# EAGLE schematic morse (EAGLE 7.0.0)
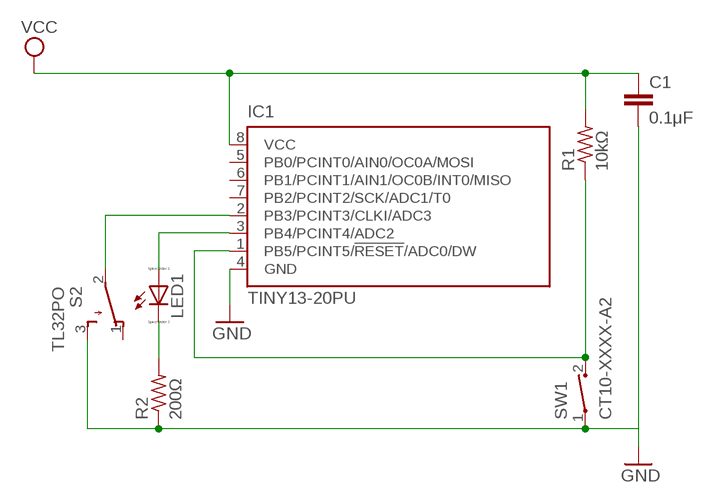
[diagram p0: schematic, sheet 1]

## Parts
C1  0.1μF  C2,5-3  [C2.5-3]
IC1  TINY13-20PU  [DIL08]
LED1  LED_ELD260  [LED_LD260]
R1  10kΩ  R-US_0204/7  [0204/7]
R2  200Ω  R-US_0204/7  [0204/7]
S2  TL32PO  [TL3XPO]
SW1  CT10-XXXX-A2  [CT10-XXXX-A2]

## Nets
GND: C1.2 IC1.4(GND) R2.1 S2.3(S) SW1.1
N$1: IC1.1(PB5/PCINT5/!RESET!/ADC0/DW) R1.1 SW1.2
N$2: IC1.3(PB4/PCINT4/ADC2) LED1.A
N$3: LED1.K(C) R2.2
N$4: IC1.2(PB3/PCINT3/CLKI/ADC3) S2.2(P)
VCC: C1.1 IC1.8(VCC) R1.2
Unconnected: IC1.5(PB0/PCINT0/AIN0/OC0A/MOSI) IC1.6(PB1/PCINT1/AIN1/OC0B/INT0/MISO) IC1.7(PB2/PCINT2/SCK/ADC1/T0) S2.1(O)

## Library data of the parts
C1 = capacitor-wima:C: CAPACITOR naming: grid - package width
IC1 = atmel:TINY13: 8-bit AVR Microcontroller with 1K Bytes In-System Programmable Flash Source: http://www.atmel.com/dyn/resources/prod_documents/2535S.pdf; MPN: ATTINY13-20PU; OC_FARNELL: 9171550; OC_NEWARK: 96K6521
LED1 = eagle-ltspice:LED_E: LED Source: http://www.osram.convergy.de Source: www.luxeon.com Source: www.kingbright.com; SPICEMODEL: NONE; SPICEPREFIX: D; SPICETYPE: diode
R1 R2 = rcl:R-US_: RESISTOR, American symbol
S2 = switch:TL32PO: TINY SWITCH ON - MOM Source: http://www2.produktinfo.conrad.com/datenblaetter/700000-724999/705152-da-01-de-Subminiaturschalter_TL_36YO.pdf
SW1 = switch-coto:CT10-XXXX-: CT10 Series Molded Switch Source: www.cotorelay.com .. Coto_Technology__CT10-1530-G1.pdf